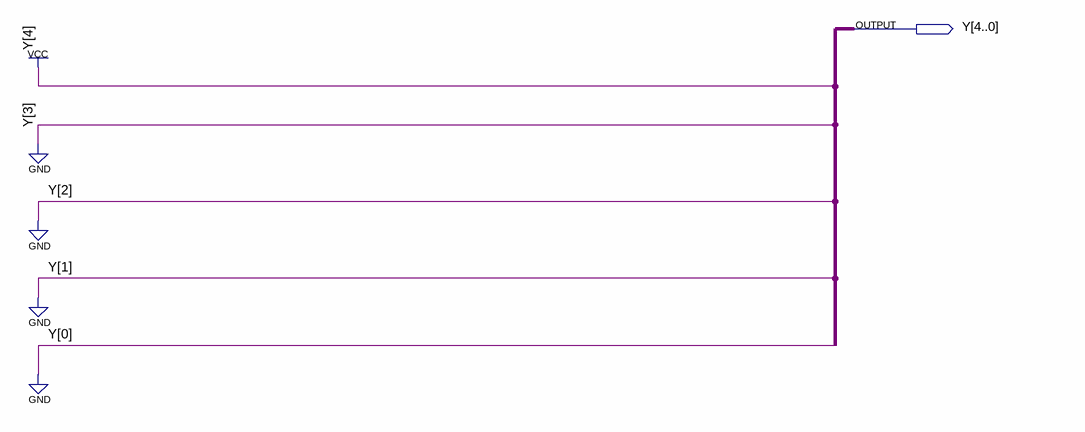
[diagram p0: schematic sheet]
// Quartus schematic Sixteen.bdf as structural Verilog: 0 symbols, 1 pins
module Sixteen (
  output [4:0] Y
);


  assign Y = 5'b10000;
endmodule
